# Altium project Intelliflow_V_2.PrjPcb
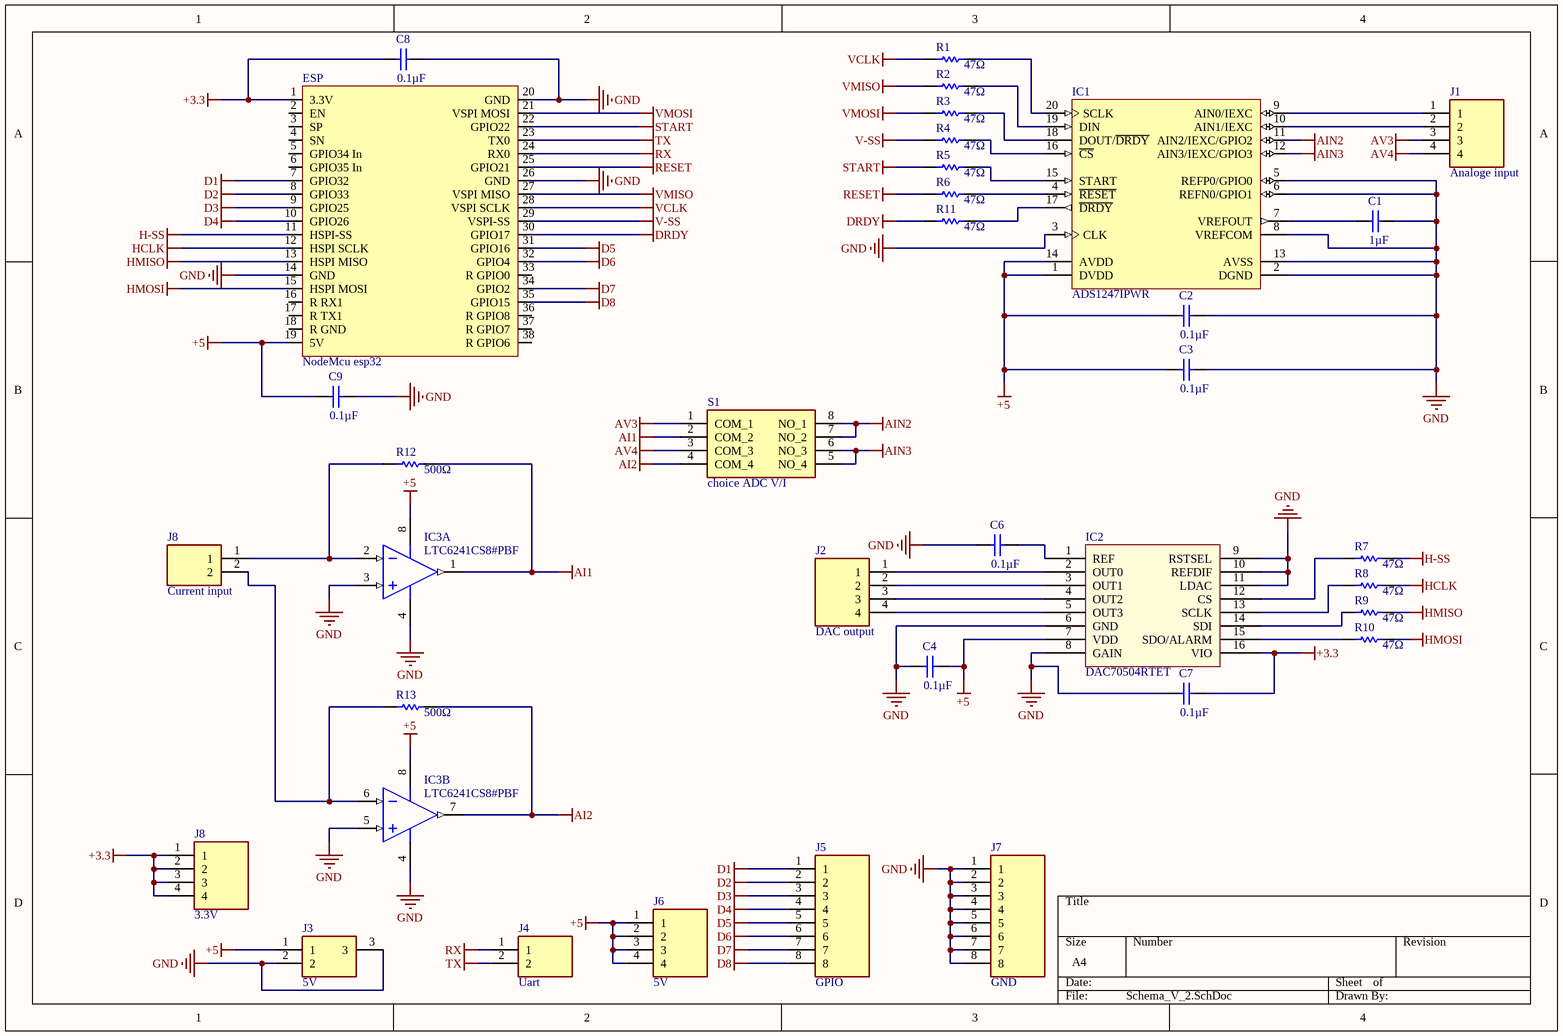
[diagram p0: Schema_V_2.SchDoc]
1 sheet, 35 parts. Net scope: global (net labels, ports and power ports of the same name join across sheets).
Board files: PCB_V_2.PcbDoc, PCB_V_2_withgroundplane.PcbDoc

## Sheet Schema_V_2.SchDoc
size A4

### Parts
(Parts that share a designator on the sheet are numbered #1, #2 ... from top to bottom, then left to right.)
C1  value 1µF  [6-0805_N]  (hidden comment: Cap)
C2  value 0.1µF  [6-0805_N]  (hidden comment: Cap)
C3  value 0.1µF  [6-0805_N]  (hidden comment: Cap)
C4  value 0.1µF  [6-0805_N]  (hidden comment: Cap)
C6  value 0.1µF  [6-0805_N]  (hidden comment: Cap)
C7  value 0.1µF  [6-0805_N]  (hidden comment: Cap)
C8  value 0.1µF  [6-0805_N]  (hidden comment: Cap)
C9  value 0.1µF  [6-0805_N]  (hidden comment: Cap)
ESP  NodeMcu esp32  [esp32_nodemcu_v2]
IC1  ADS1247IPWR  [TI-PW20_M]
IC2  DAC70504RTET  [QFN50P300X300X80-17N]
IC3  LTC6241CS8#PBF  [LT-S8-8_M]  (parts A,B of 2)
J1  Analoge input  [TB00450804BE]
J2  DAC output  [TB00450804BE]
J3  5V  [PJ002BH]
J4  Uart  [SHDR2W100P0X508_1X2_1016X1020X1410P]
J5  GPIO  [TB00450808BE]
J6  5V  [TB00450804BE]
J7  GND  [TB00450808BE]
J8#1  Current input  [SHDR2W100P0X508_1X2_1016X1020X1410P]
J8#2  3.3V  [TB00450804BE]
R1  value 47Ω  [6-0805_N]  (hidden comment: Res1)
R2  value 47Ω  [6-0805_N]  (hidden comment: Res1)
R3  value 47Ω  [6-0805_N]  (hidden comment: Res1)
R4  value 47Ω  [6-0805_N]  (hidden comment: Res1)
R5  value 47Ω  [6-0805_N]  (hidden comment: Res1)
R6  value 47Ω  [6-0805_N]  (hidden comment: Res1)
R7  value 47Ω  [6-0805_N]  (hidden comment: Res1)
R8  value 47Ω  [6-0805_N]  (hidden comment: Res1)
R9  value 47Ω  [6-0805_N]  (hidden comment: Res1)
R10  value 47Ω  [6-0805_N]  (hidden comment: Res1)
R11  value 47Ω  [6-0805_N]  (hidden comment: Res1)
R12  value 500Ω  [6-0805_N]  (hidden comment: Res1)
R13  value 500Ω  [6-0805_N]  (hidden comment: Res1)
S1  choice ADC V/I  [CES0402MC]

### Nets
+3.3: C7.2 C8.1 ESP.1(3.3V) IC2.16(VIO) J8#2.1 J8#2.2 J8#2.3 J8#2.4
+5: C2.1 C3.1 C4.2 C9.1 ESP.19(5V) IC1.1(DVDD) IC1.14(AVDD) IC2.7(VDD) IC3.8(V+) J3.1 J6.1 J6.2 J6.3 J6.4
AI1: IC3.1(OUT_A) R12.2 S1.2(COM_2)
AI2: IC3.7(OUT_B) R13.2 S1.4(COM_4)
AIN2: IC1.11(AIN2/IEXC/GPIO2) S1.7(NO_2) S1.8(NO_1)
AIN3: IC1.12(AIN3/IEXC/GPIO3) S1.5(NO_4) S1.6(NO_3)
AV3: J1.3 S1.1(COM_1)
AV4: J1.4 S1.3(COM_3)
D1: ESP.7(GPIO32) J5.1
D2: ESP.8(GPIO33) J5.2
D3: ESP.9(GPIO25) J5.3
D4: ESP.10(GPIO26) J5.4
D5: ESP.31(GPIO16) J5.5
D6: ESP.32(GPIO4) J5.6
D7: ESP.34(GPIO2) J5.7
D8: ESP.35(GPIO15) J5.8
DRDY: ESP.30(GPIO17) R11.1
GND: C1.2 C2.2 C3.2 C4.1 C6.1 C7.1 C8.2 C9.2 ESP.14(GND) ESP.20(GND) ESP.26(GND) IC1.2(DGND) IC1.3(CLK) IC1.5(REFP0/GPIO0) IC1.6(REFN0/GPIO1) IC1.8(VREFCOM) IC1.13(AVSS) IC2.6(GND) IC2.8(GAIN) IC2.9(RSTSEL) IC2.10(REFDIF) IC2.11(LDAC) IC3.3(+IN_A) IC3.4(V-) IC3.5(+IN_B) J3.2 J3.3 J7.1 J7.2 J7.3 J7.4 J7.5 J7.6 J7.7 J7.8
H-SS: ESP.11(HSPI-SS) R7.2
HCLK: ESP.12(HSPI_SCLK) R8.2
HMISO: ESP.13(HSPI_MISO) R9.2
HMOSI: ESP.15(HSPI_MOSI) R10.2
RESET: ESP.25(GPIO21) R6.1
RX: ESP.24(RX0) J4.1
START: ESP.22(GPIO22) R5.1
TX: ESP.23(TX0) J4.2
V-SS: ESP.29(VSPI-SS) R4.1
VCLK: ESP.28(VSPI_SCLK) R1.1
VMISO: ESP.27(VSPI_MISO) R2.1
VMOSI: ESP.21(VSPI_MOSI) R3.1
NetC1_1: C1.1 IC1.7(VREFOUT)
NetC6_2: C6.2 IC2.1(REF)
NetIC1_4: IC1.4(~{RESET}) R6.2
NetIC1_9: IC1.9(AIN0/IEXC) J1.1
NetIC1_10: IC1.10(AIN1/IEXC) J1.2
NetIC1_15: IC1.15(START) R5.2
NetIC1_16: IC1.16(~{CS}) R4.2
NetIC1_17: IC1.17(~{DRDY}) R11.2
NetIC1_18: IC1.18(DOUT/~{DRDY}) R3.2
NetIC1_19: IC1.19(DIN) R2.2
NetIC1_20: IC1.20(SCLK) R1.2
NetIC2_2: IC2.2(OUT0) J2.1
NetIC2_3: IC2.3(OUT1) J2.2
NetIC2_4: IC2.4(OUT2) J2.3
NetIC2_5: IC2.5(OUT3) J2.4
NetIC2_12: IC2.12(CS) R7.1
NetIC2_13: IC2.13(SCLK) R8.1
NetIC2_14: IC2.14(SDI) R9.1
NetIC2_15: IC2.15(SDO/ALARM) R10.1
NetIC3_2: IC3.2(-IN_A) J8#1.1 R12.1
NetIC3_6: IC3.6(-IN_B) J8#1.2 R13.1

Not connected (* = marked no-connect by the designer): ESP 2(EN) 3(SP) 4(SN) 5(GPIO34_In) 6(GPIO35_In) 16(R_RX1) 17(R_TX1) 18(R_GND) 33(R_GPIO0) 36(R_GPIO8) 37(R_GPIO7) 38(R_GPIO6)

### Library data of the parts
C1-C4 C6-C9 = Cap: Capacitor; Published: 8-Jun-2000; LatestRevisionDate: 17-Jul-2002; LatestRevisionNote: Re-released for DXP Platform.; PackageReference: RAD-0.3; Publisher: Altium Limited; PackageDescription: Radial Cap, Thru-Hole; 2 Leads; 0.3 in Pin Spacing
IC1 = CMP-0003-00816-2: Low Noise, Precision 24-Bit ADC, -40 to 105 degC, 20-pin SOP (PW20), Green (RoHS & no Sb/Br); Manufacturer: Texas Instruments; Interface: Serial SPI; Analog Voltage AV/DD(Max)(V): 5.25; SubFamily: Precision ADC (<=10MSPS); Resolution(Bits): 24; Architecture: Delta-Sigma; Digital Supply(Min)(V): 2.7; # Input Channels: 3; Sample Rate (max)(SPS): 2k; PartNumber: ADS1247IPWR; ComponentLink3Description: Package Specification; ComponentLink1URL: http://www.ti.com/; Eco-Plan: Green (RoHS & no Sb/Br); PackageDescription: 20-Pin Plastic Small Outline, Body 6.5 x 4.4 mm, Pitch 0.65 mm; ComponentLink2Description: Datasheet; PackageVersion: 4040064-5/G, 02/2011; Mounting Technology: Surface Mount; PackageReference: PW20; ComponentLink1Description: Manufacturer URL; Code_JEDEC: MO-153; Digital Supply(Max)(V): 5.25; ComponentLink3URL: http://www.ti.com.cn/cn/lit/ml/mpds362/mpds362.pdf; DatasheetVersion: SBAS426G; ComponentLink2URL: http://www.ti.com/general/docs/lit/getliterature.tsp?genericPartNumber=ADS1247&fileType=pdf; Analog Voltage AV/DD(Min)(V): 2.7
IC2 = Component_1
IC3 = CMP-0359-02669-2: Dual Channel, Low Noise, CMOS Operational Amplifier, RRO, 18 MHz Typical GBW, 10 V/us Typical SR, 2.8 to 6 V, 8-Pin SOIC (S8-8), Commercial, Pb-Free; Manufacturer: Linear Technology; Vos (mV) Typical: 0.04; Channels (#): 2; Is (mA) Typical: 1.8; Vs Max (V): 6; Vs Min (V): 2.8; SR (V/us) Typical: 10; GBW (MHz) Typical: 18; ComponentLink2Description: Datasheet; PackageVersion: Rev G; PackageDescription: 8-Pin Plastic Small Outline, Body 4.9 x 3.9 mm, Pitch 1.27 mm; Linear Technology Part Number: LTC6241; RoHS: Pb-Free; PackageReference: LT-S8-8; DatasheetVersion: Rev. E; ComponentLink1URL: http://www.linear.com/; ComponentLink1Description: Manufacturer URL; Mounting Technology: Surface Mount; ComponentLink3Description: Package Specification; PartNumber: LTC6241CS8#PBF; ComponentLink3URL: http://cds.linear.com/docs/en/packaging/05081610_G_SO8.pdf; RevisionNote: URLs updated; Type: VFB; ComponentLink2URL: http://cds.linear.com/docs/en/datasheet/624012fe.pdf
J1 J2 J6 J8#2 = TB004-508-04BE: Connector; Manufacturer_Name: CUI Devices; Datasheet Link: https://www.mouser.de/datasheet/2/670/tb004-508-1550640.pdf; Height: 14.5mm; Manufacturer_Part_Number: TB004-508-04BE; Mouser Part Number: 490-TB004-508-04BE; Mouser Price/Stock: https://www.mouser.co.uk/ProductDetail/CUI-Devices/TB004-508-04BE?qs=vLWxofP3U2xBEXp2FgncVQ%3D%3D
J3 = PJ-002BH: Connector; Manufacturer_Name: CUI Devices; Datasheet Link: https://componentsearchengine.com/Datasheets/1/PJ-002BH.pdf; Height: 11mm; Manufacturer_Part_Number: PJ-002BH; Arrow Part Number: PJ-002BH; Arrow Price/Stock: https://www.arrow.com/en/products/pj-002bh/cui-devices; Mouser Part Number: 490-PJ-002BH; Mouser Price/Stock: https://www.mouser.co.uk/ProductDetail/CUI-Devices/PJ-002BH?qs=WyjlAZoYn51nOX1h%2FqpLlg%3D%3D
J4 J8#1 = TB004-508-02BE: Connector; Manufacturer_Name: CUI Devices; Datasheet Link: https://componentsearchengine.com/Datasheets/1/TB004-508-02BE.pdf; Height: 14.1mm; Manufacturer_Part_Number: TB004-508-02BE; Arrow Part Number: TB004-508-02BE; Arrow Price/Stock: https://www.arrow.com/en/products/tb004-508-02be/cui-inc; Mouser Part Number: 490-TB004-508-02BE; Mouser Price/Stock: https://www.mouser.co.uk/ProductDetail/CUI-Devices/TB004-508-02BE?qs=vLWxofP3U2zLwdGzG2tSkA%3D%3D
J5 J7 = TB004-508-08BE: Connector; Manufacturer_Name: CUI Devices; Datasheet Link: https://www.mouser.de/datasheet/2/670/tb004-508-1550640.pdf; Height: 14.5mm; Manufacturer_Part_Number: TB004-508-08BE; Mouser Part Number: 490-TB004-508-08BE; Mouser Price/Stock: https://www.mouser.co.uk/ProductDetail/CUI-Devices/TB004-508-08BE?qs=vLWxofP3U2zcPMkVrCo9Rw%3D%3D
R1-R13 = Res1: Resistor; Published: 8-Jun-2000; LatestRevisionDate: 17-Jul-2002; LatestRevisionNote: Re-released for DXP Platform.; PackageReference: AXIAL-0.3; Publisher: Altium Limited; PackageDescription: Axial Device, Thru-Hole; 2 Leads; 0.3 in Pin Spacing
S1 = CES-0402MC: Switch; Manufacturer_Name: Copal Electronics; Datasheet Link: https://www.nidec-copal-electronics.com/e/catalog/switch/ces.pdf; Height: 12.3mm; Manufacturer_Part_Number: CES-0402MC